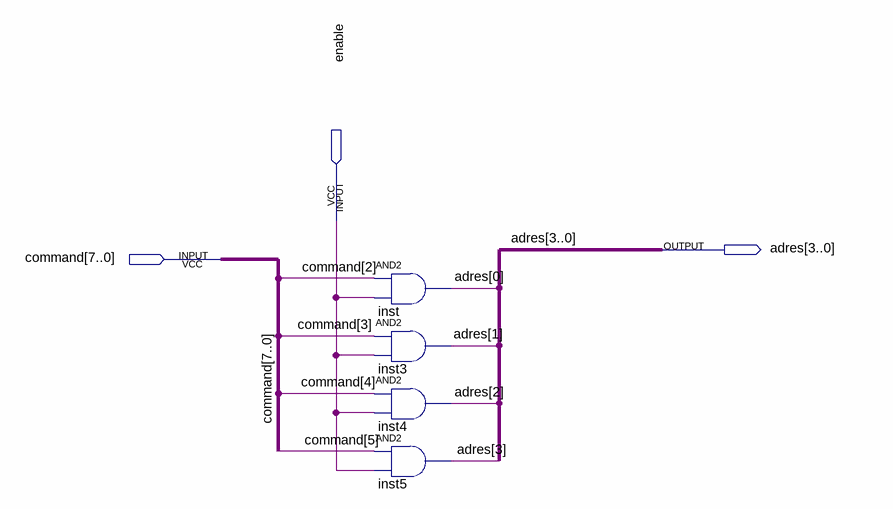
[diagram p0: schematic sheet]
// Quartus schematic adapter8x4.bdf as structural Verilog: 4 symbols, 3 pins
module adapter8x4 (
  input  enable,
  input  [7:0] command,
  output [3:0] adres
);

  and inst (adres[0], command[2], enable);
  and inst3 (adres[1], command[3], enable);
  and inst4 (adres[2], command[4], enable);
  and inst5 (adres[3], command[5], enable);
endmodule
